# EAGLE design pc_power_on_555 (EAGLE 7.6.0)
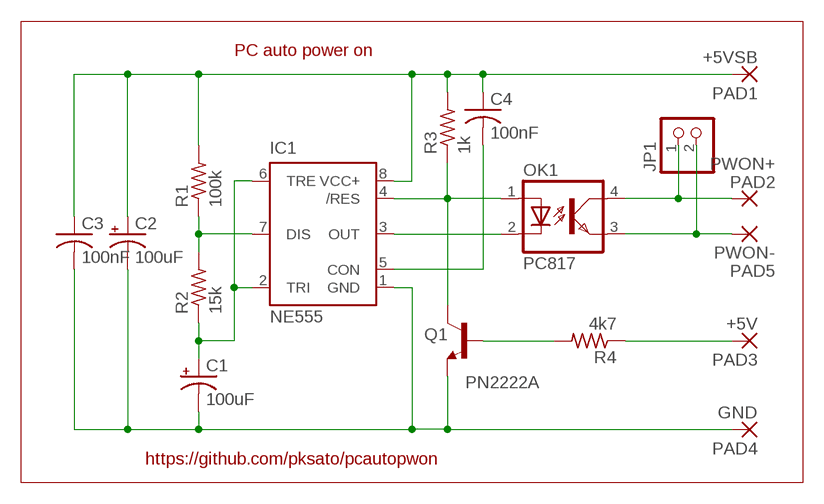
[diagram p0: schematic, sheet 1]

## Parts
C1  100uF  CPOL-USE2.5-7  [E2,5-7]
C2  100uF  CPOL-USE2.5-7  [E2,5-7]
C3  100nF  C-US025-030X050  [C025-030X050]
C4  100nF  C-US025-030X050  [C025-030X050]
IC1  NE555  [DIL-08]
JP1  PINHD-1X2  [1X02]
OK1  PC817  [DIL04]
PAD1  +5VSB  WIREPAD1,6/0,8  [1,6/0,8]
PAD2  PWON+  WIREPAD1,6/0,8  [1,6/0,8]
PAD3  +5V  WIREPAD1,6/0,8  [1,6/0,8]
PAD4  GND  WIREPAD1,6/0,8  [1,6/0,8]
PAD5  PWON-  WIREPAD1,6/0,8  [1,6/0,8]
Q1  PN2222A  2N2222-NPN-TO92-EBC  [TO92-EBC]
R1  100k  R-US_0207/10  [0207/10]
R2  15k  R-US_0207/10  [0207/10]
R3  1k  R-US_0207/10  [0207/10]
R4  4k7  R-US_0207/10  [0207/10]

## Nets
N$1: C1.+ IC1.2(TRI) IC1.6(TRE) R2.1
N$2: IC1.7(DIS) R1.1 R2.2
N$3: IC1.3(OUT) OK1.2(C)
N$4: C2.+ C3.1 C4.1 IC1.8(VCC+) PAD1.1(P) R1.2 R3.2
N$6: IC1.4(/RES) OK1.1(A) Q1.C R3.1
N$7: C1.- C2.- C3.2 IC1.1(GND) PAD4.1(P) Q1.E
N$8: JP1.2 OK1.3(EMIT) PAD5.1(P)
N$9: JP1.1 OK1.4(COL) PAD2.1(P)
N$11: Q1.B R4.2
N$13: PAD3.1(P) R4.1
N$15: C4.2 IC1.5(CON)

## Notes on the sheet
- PC auto power on
- https://github.com/pksato/pcautopwon

## Library data of the parts
C1 C2 = rcl:CPOL-US: POLARIZED CAPACITOR, American symbol
C3 C4 = rcl:C-US: CAPACITOR, American symbol
IC1 = st-microelectronics:NE555: General purpose bipolar Timer; MF: Arrow Electronics; MPN: NE555N; OC_FARNELL: 1467742; OC_NEWARK: 89K1486
JP1 = pinhead:PINHD-1X2: PIN HEADER
OK1 = optocoupler:PC817: SHARP OPTO COUPLER; MPN: PC817X4J000F; OC_FARNELL: 9707727; OC_NEWARK: 97K7059
PAD1-PAD5 = wirepad:WIREPAD: Wire PAD connect wire on PCB
Q1 = transistor-neu-to92:*-NPN-: NPN Transistror
R1-R4 = rcl:R-US_: RESISTOR, American symbol

## Board
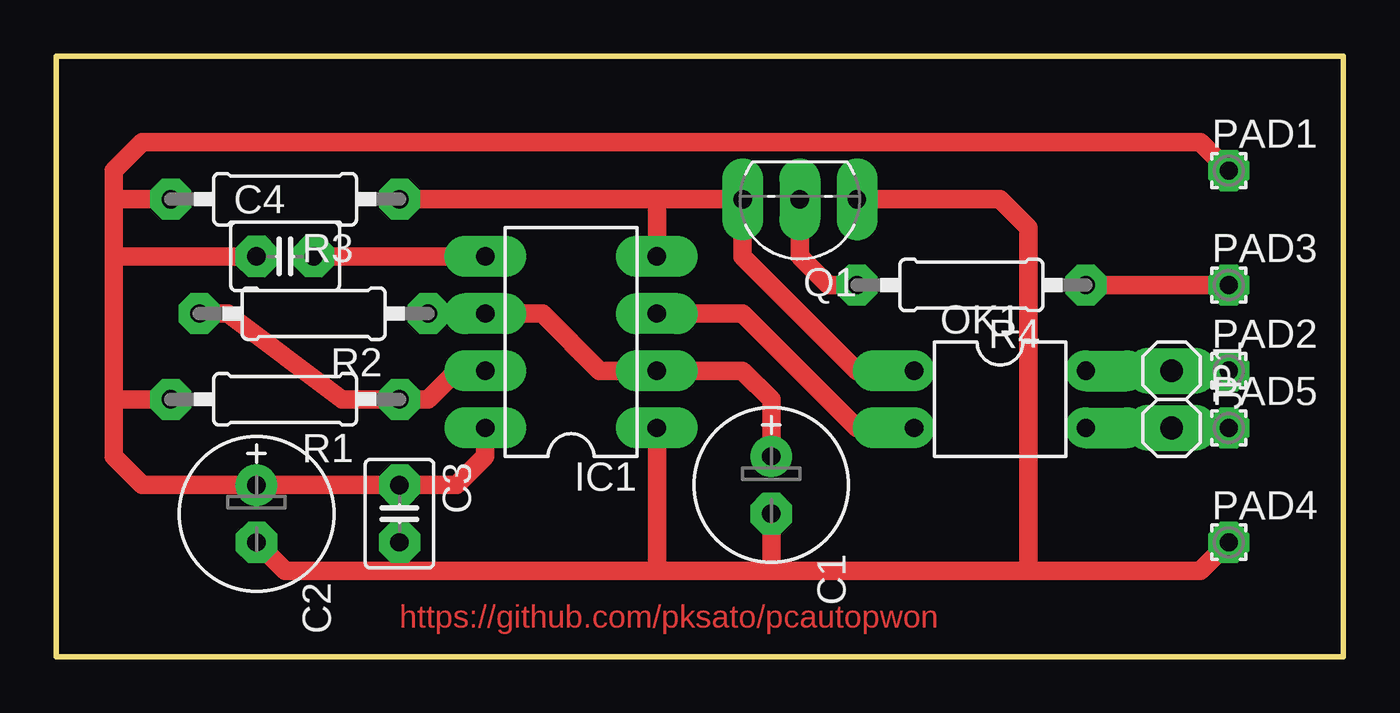
[diagram p1: board, top side]

Size 57.15 x 26.67 mm. Coordinates in mm from the lower left corner, seen from the top.
Outline: 0,0 57.15,0 57.15,26.67 0,26.67 0,0
Copper layers (1*16): Top 0.035mm / dielectric 1.5mm / Bottom 0.035mm
Design rules "default *": minimum track width 10mil, minimum drill 24mil, track to track 8mil, track to pad 8mil, pad to pad 8mil, via to via 8mil, smd to smd 8mil, copper to edge 40mil, drill to drill 8mil, minimum pad ring 20mil, minimum via ring 8mil, stop-mask expansion 4mil, vias tented up to drill 0mil, thermal gap 10mil

### Footprints (pad centres in the part's own frame; a part is rotated, then mirrored left to right if it is on the bottom)
E2,5-7 = drill 0.813 pad 1.6: + -1.27,0 | drill 0.813 pad 1.6 octagon: - 1.27,0
C025-030X050 = drill 0.813 octagon: 1 -1.27,0; 2 1.27,0
DIL-08 = drill 0.813 long: 1 -3.81,-3.81; 2 -1.27,-3.81; 3 1.27,-3.81; 4 3.81,-3.81; 5 3.81,3.81; 6 1.27,3.81; 7 -1.27,3.81; 8 -3.81,3.81
1X02 = drill 1.016 long: 1 -1.27,0; 2 1.27,0
DIL04 = drill 0.813 offset: 1 -1.27,-3.81; 2 1.27,-3.81; 3 1.27,3.81; 4 -1.27,3.81
1,6/0,8 = drill 0.813 pad 1.6 octagon: 1 0,0
TO92-EBC = drill 0.813 long: B 0,-1.27; C 2.54,-1.27; E -2.54,-1.27
0207/10 = drill 0.813 octagon: 1 -5.08,0; 2 5.08,0

### Placement (x,y rotation side)
C1  31.75,7.62 270 top
C2  8.89,6.35 270 top
C3  15.24,6.35 270 top
C4  10.16,17.78 0 top
IC1  22.86,13.97 90 top
JP1  49.53,11.43 270 top
OK1  41.91,11.43 270 top
PAD1  52.07,21.59 0 top
PAD2  52.07,12.7 0 top
PAD3  52.07,16.51 0 top
PAD4  52.07,5.08 0 top
PAD5  52.07,10.16 0 top
Q1  33.02,19.05 180 top
R1  10.16,11.43 180 top
R2  11.43,15.24 180 top
R3  10.16,20.32 180 top
R4  40.64,16.51 180 top

### Tracks (layer width: path | path; a pad name or v marks a point on that pad's centre or on a via)
N$1
  Top 0.813: C1.+ 31.75,11.43 30.48,12.7 IC1.2 24.13,12.7 21.59,15.24 IC1.6 R2.1
N$2
  Top 0.813: IC1.7 17.78,12.7 16.51,11.43 R1.1 12.7,11.43 7.62,15.24 R2.2
N$3
  Top 0.813: IC1.3 30.48,15.24 35.56,10.16 OK1.2
N$4
  Top 0.813: IC1.8 19.05,8.89 17.78,7.62 C3.1 C2.+ 3.81,7.62 2.54,8.89 2.54,11.43 | R3.2 2.54,20.32 | 2.54,20.32 2.54,17.78 | 2.54,17.78 2.54,11.43 | R1.2 2.54,11.43 | PAD1.1 50.8,22.86 3.81,22.86 2.54,21.59 2.54,20.32 | C4.1 2.54,17.78
N$6
  Top 0.813: R3.1 26.67,20.32 | 26.67,20.32 IC1.4 | 26.67,20.32 Q1.C 30.48,17.78 35.56,12.7 OK1.1
N$7
  Top 0.813: PAD4.1 50.8,3.81 43.18,3.81 | 43.18,3.81 31.75,3.81 | 31.75,3.81 26.67,3.81 | 26.67,3.81 15.24,3.81 | 15.24,3.81 10.16,3.81 C2.- | IC1.1 26.67,3.81 | Q1.E 41.91,20.32 43.18,19.05 43.18,3.81 | C3.2 15.24,3.81 | C1.- 31.75,3.81
N$8
  Top 0.813: OK1.3 JP1.2 PAD5.1
N$9
  Top 0.813: OK1.4 JP1.1 PAD2.1
N$11
  Top 0.813: Q1.B 33.02,17.78 34.29,16.51 R4.2
N$13
  Top 0.813: R4.1 PAD3.1
N$15
  Top 0.813: IC1.5 C4.2

### Text on the board
Top: https://github.com/pksato/pcautopwon